# Altium project AgriBacKanCircuit.PrjPcb
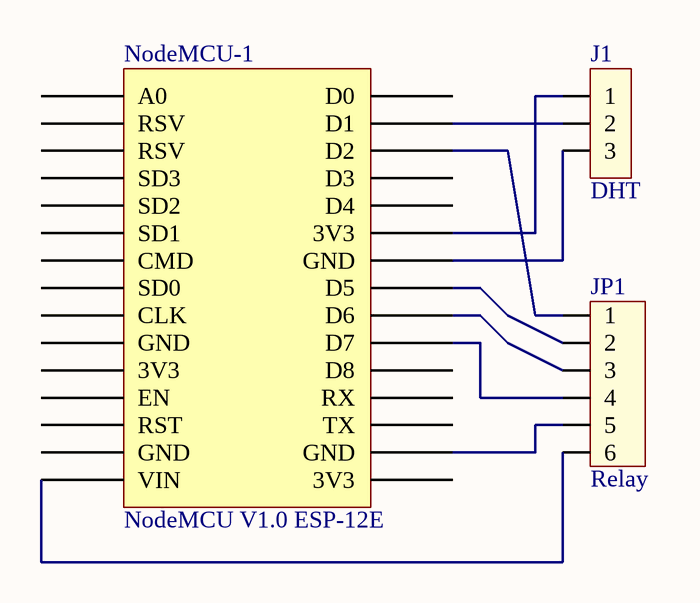
[diagram p0: Sheet1.SchDoc]
1 sheet, 3 parts. Net scope: global (net labels, ports and power ports of the same name join across sheets).
Board file: PCB1.PcbDoc

## Sheet Sheet1.SchDoc
size A

### Parts
J1  DHT  [JP3]
JP1  Relay  [CON6]
NodeMCU-1  NodeMCU V1.0 ESP-12E  [NodeMCU V1.0 ESP-12E]

### Nets
NetJ1_1: J1.1 NodeMCU-1.3V3
NetJ1_2: J1.2 NodeMCU-1.D1
NetJ1_3: J1.3 NodeMCU-1.GND
NetJP1_1: JP1.1 NodeMCU-1.D2
NetJP1_2: JP1.2 NodeMCU-1.D5
NetJP1_3: JP1.3 NodeMCU-1.D6
NetJP1_4: JP1.4 NodeMCU-1.D7
NetJP1_5: JP1.5 NodeMCU-1.GND
NetJP1_6: JP1.6 NodeMCU-1.VIN

Not connected (* = marked no-connect by the designer): NodeMCU-1 A0 CLK CMD D0 D3 D4 D8 EN RST RSV RX SD0 SD1 SD2 SD3 TX

### Library data of the parts
J1 = JP3: Jumper 3; Value: J3
JP1 = Con6: Connector 6; Value: Connector 6
NodeMCU-1 = NodeMCU V1.0 ESP-12E: NodeMCU V1.0 ESP8266 (ESP-12E)